# Altium schematic sheet lpf_80.SchDoc: mcHF Pro Transceiver RF board
size A3; Author: Krassi Atanassov; CompanyName: MØNKA; Engineer: For radio amateurs experimentation, non-commercial use only. Thank you!; Revision: 0.8.2; SheetTotal: 14
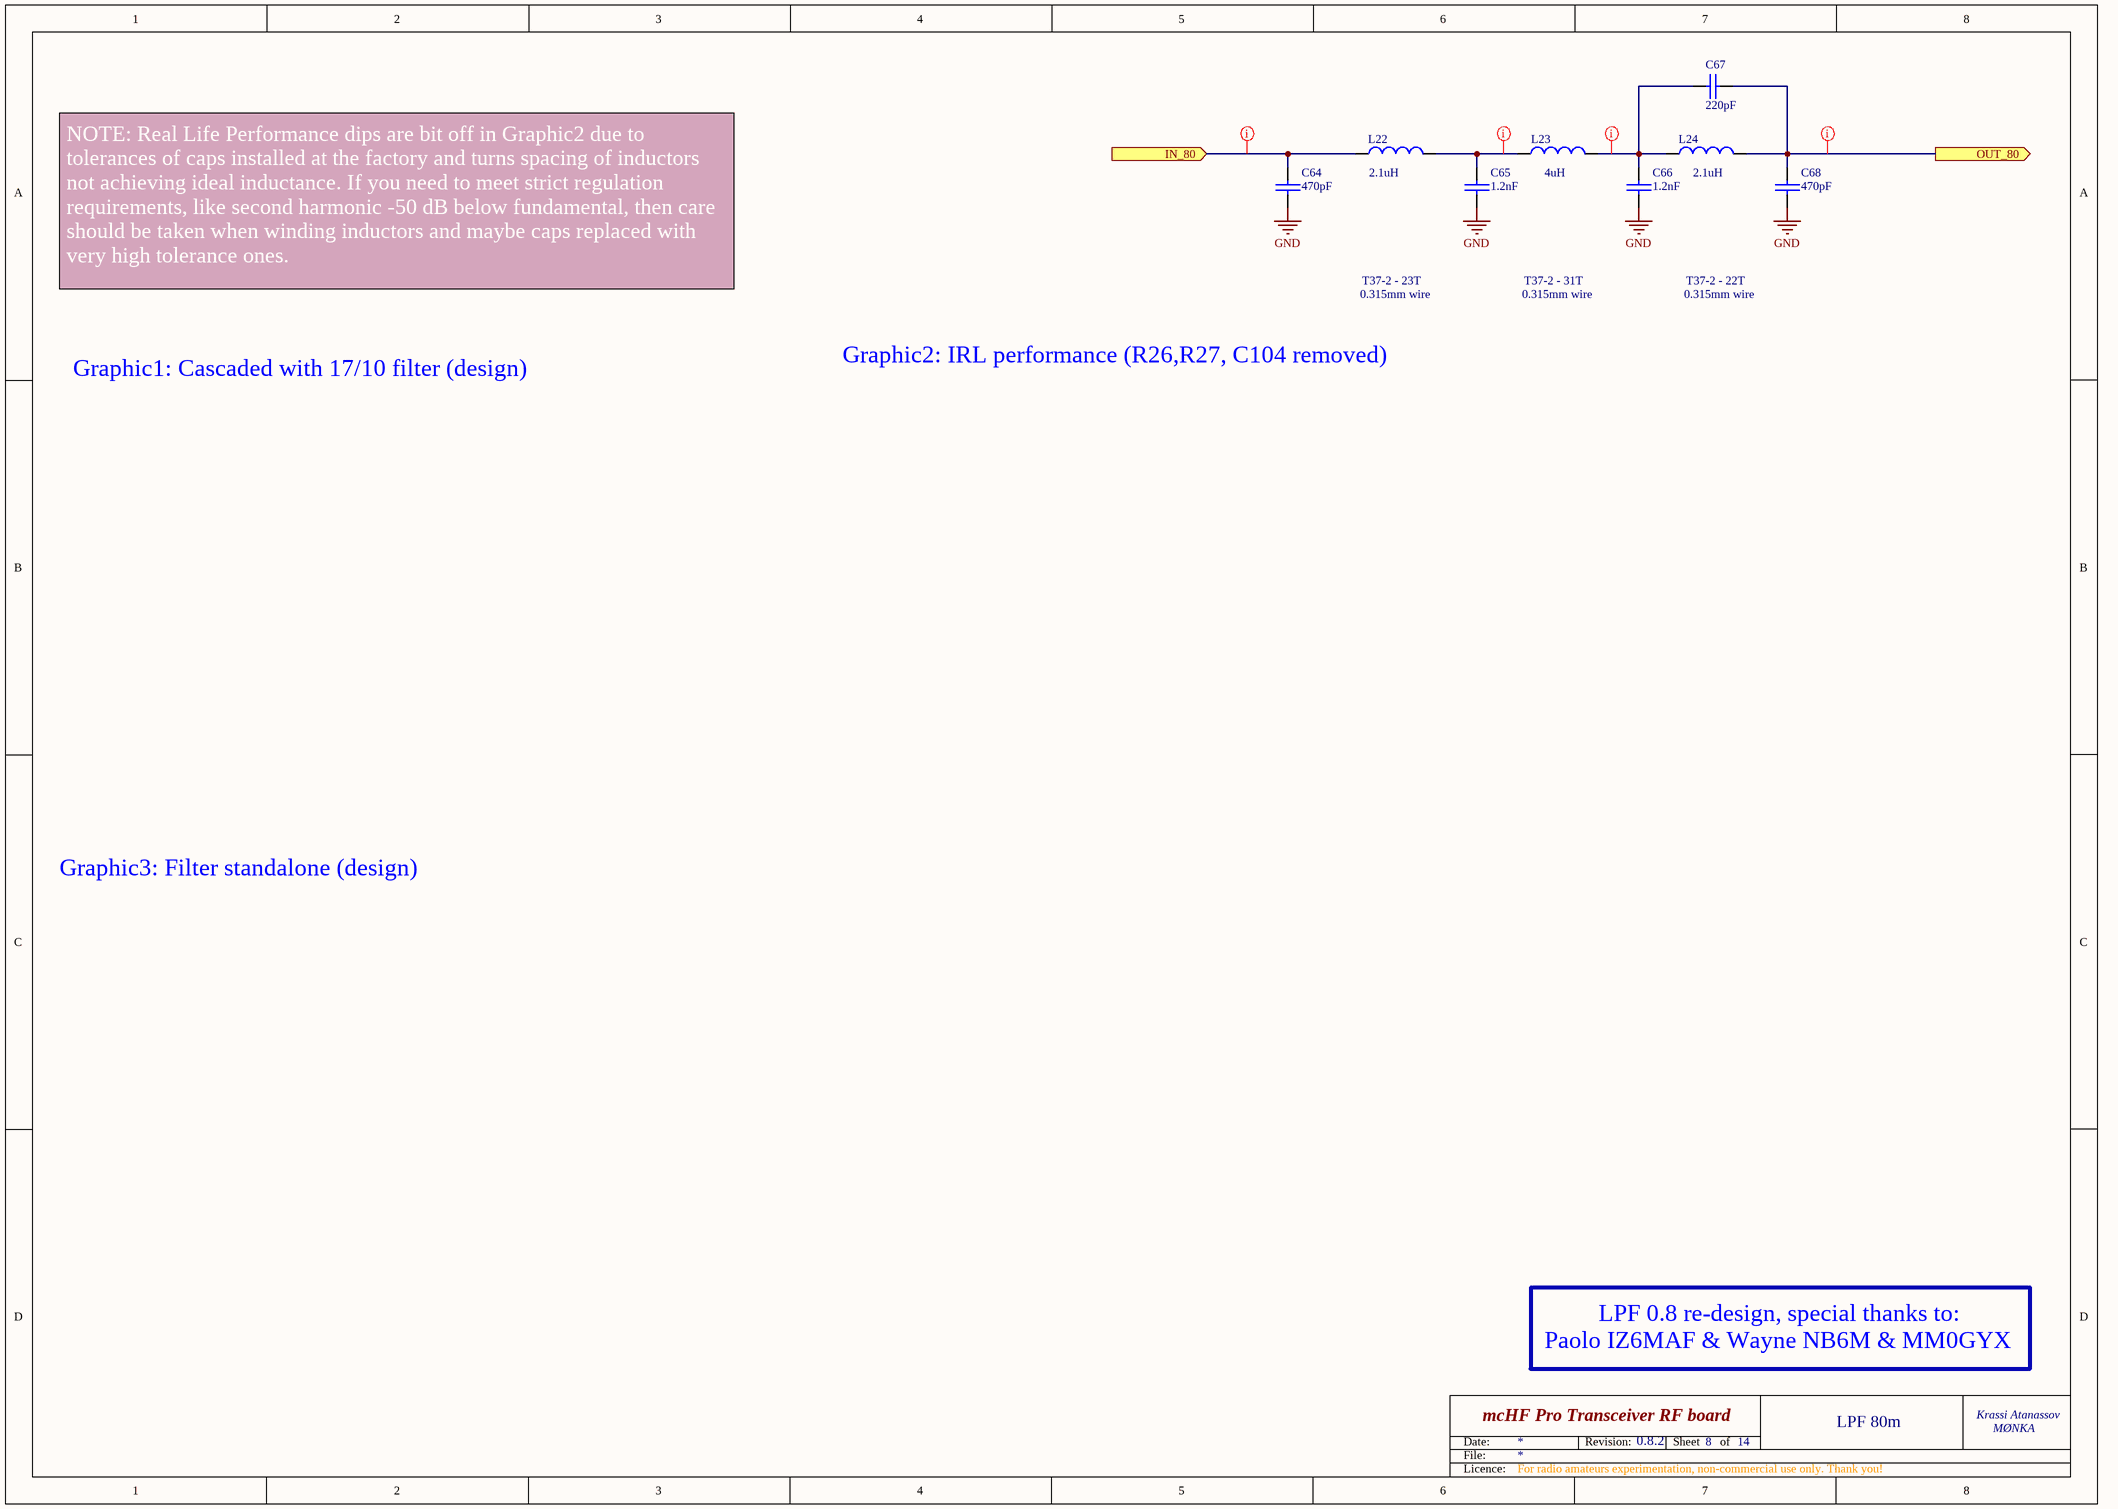
[diagram p0: lpf_80.SchDoc]

## Parts
C64  470pF  [0805]
C65  1.2nF  [0805]
C66  1.2nF  [0805]
C67  220pF  [0805]
C68  470pF  [0805]
L22  Inductance: 2.1uH  [LPF_IND]  (hidden comment: T37-2)
L23  Inductance: 4uH  [LPF_IND]  (hidden comment: T37-2)
L24  Inductance: 2.1uH  [LPF_IND]  (hidden comment: T37-2)

## Ports
IN_80 (in), OUT_80 (out)

## Nets
GND: C64.2 C65.2 C66.2 C68.2
IN_80: C64.1 L22.1 ; port IN_80
OUT_80: C67.1 C68.1 L24.2 ; port OUT_80
NetC65_1: C65.1 L22.2 L23.1
NetC66_1: C66.1 C67.2 L23.2 L24.1

## Layout directives
rule Width Constraint [Pref Width = 30mil    Min Width = 30mil    Max Width = 30mil]: IN_80, NetC65_1, NetC66_1, OUT_80

## Notes on the sheet
- NOTE: Real Life Performance dips are bit off in Graphic2 due to tolerances of caps installed at the factory and turns spacing of inductors not achieving ideal inductance. If you need to meet strict regulation requirements, like second harmonic -50 dB below fundamental, then care should be taken when winding inductors and maybe caps replaced with very high tolerance ones.
- T37-2 - 23T
- 0.315mm wire
- T37-2 - 31T
- T37-2 - 22T
- Graphic1: Cascaded with 17/10 filter (design)
- Graphic2: IRL performance (R26,R27, C104 removed)
- Graphic3: Filter standalone (design)
- LPF 0.8 re-design, special thanks to:
- Paolo IZ6MAF & Wayne NB6M & MM0GYX
- 8
- LPF 80m
- Date:
- File:
- Revision:
- Sheet
- of
- Licence:

## Library data of the parts
C64 C68 = CAP: Capacitor; QT Order: QCC-00460; Notes: COG/NPO; Voltage: 100V; Price: 0.063
C65 C66 = CAP: Capacitor; QT Order: QCC-00142; Notes: COG/NPO; Voltage: 100V; Price: 0.143
C67 = CAP: Capacitor; Notes: COG/NPO; Voltage: 100V; Price: 0.068
L22-L24 = LPF_IND: T37-2 handwound inductor; Notes: post assembly; Price: 0.20